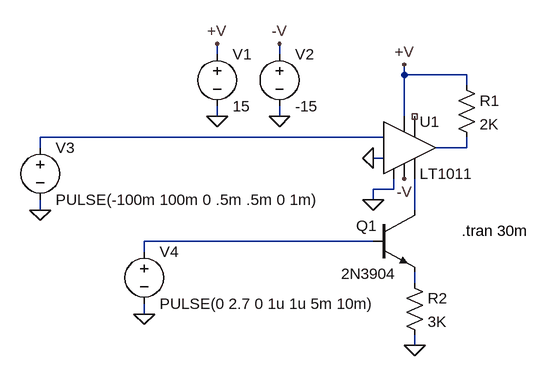
[diagram p0: schematic 1011.asc]
1011.asc, the LTspice schematic file:
Version 4
SHEET 1 880 680
WIRE -384 96 -384 80
WIRE -288 96 -288 80
WIRE -96 128 -96 112
WIRE 0 128 -96 128
WIRE 0 144 0 128
WIRE -384 192 -384 176
WIRE -288 192 -288 176
WIRE -96 192 -96 128
WIRE -128 224 -656 224
WIRE -656 240 -656 224
WIRE 0 240 0 224
WIRE 0 240 -48 240
WIRE -128 256 -144 256
WIRE -112 304 -112 288
WIRE -112 304 -144 304
WIRE -144 320 -144 304
WIRE -656 336 -656 320
WIRE -80 336 -80 288
WIRE -144 384 -496 384
WIRE -496 400 -496 384
WIRE -80 448 -80 432
WIRE -496 496 -496 480
WIRE -80 544 -80 528
FLAG -288 192 0
FLAG -384 192 0
FLAG -384 80 +V
FLAG -96 288 -V
FLAG -288 80 -V
FLAG -96 112 +V
FLAG -656 336 0
FLAG -144 256 0
FLAG -80 544 0
FLAG -496 496 0
FLAG -144 320 0
SYMBOL Comparators\\LT1011 -96 240 R0
SYMATTR InstName U1
SYMBOL voltage -384 80 R0
SYMATTR InstName V1
SYMATTR Value 15
SYMBOL voltage -288 80 R0
SYMATTR InstName V2
SYMATTR Value -15
SYMBOL voltage -656 224 R0
WINDOW 123 0 0 Left 0
WINDOW 39 0 0 Left 0
SYMATTR InstName V3
SYMATTR Value PULSE(-100m 100m 0 .5m .5m 0 1m)
SYMBOL res -16 128 R0
SYMATTR InstName R1
SYMATTR Value 2K
SYMBOL npn -144 336 R0
WINDOW 0 6 24 Right 0
WINDOW 3 36 98 Right 0
SYMATTR InstName Q1
SYMATTR Value 2N3904
SYMBOL res -96 432 R0
SYMATTR InstName R2
SYMATTR Value 3K
SYMBOL voltage -496 384 R0
SYMATTR InstName V4
SYMATTR Value PULSE(0 2.7 0 1u 1u 5m 10m)
TEXT -8 368 Left 0 !.tran 30m

The netlist it stands for:
* 1011.asc
XU1 0 0 N001 -V NC_01 N003 N002 +V LT1011
V1 +V 0 15
V2 -V 0 -15
V3 N001 0 PULSE(-100m 100m 0 .5m .5m 0 1m)
R1 +V N002 2K
Q1 N003 N004 N005 0 2N3904
R2 N005 0 3K
V4 N004 0 PULSE(0 2.7 0 1u 1u 5m 10m)
.model NPN NPN
.model PNP PNP
.lib standard.bjt
.tran 30m
.lib LTC1.lib
.backanno
.end